# EAGLE design chickengate (EAGLE 9.2.2)
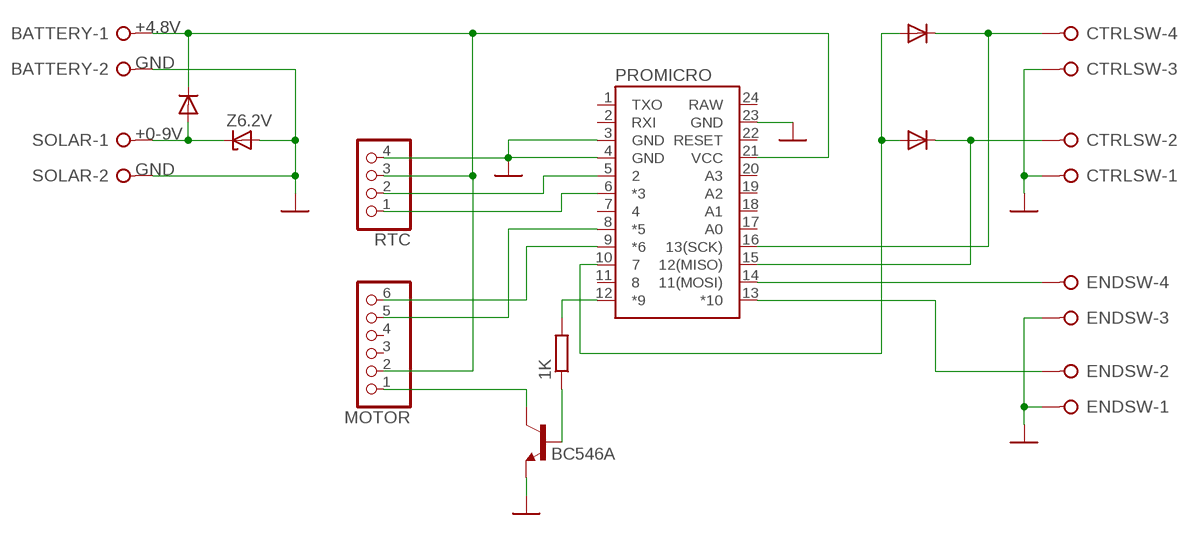
[diagram p0: schematic, sheet 1]

## Parts
1K  R-EU_0207/12  [0207/12]
BATTERY  W237-02P  [W237-132]
CTRLSW  W237-04P  [W237-4P]
D1  1N4004  [DO41-10]
D2  1N4004  [DO41-10]
D3  1N4004  [DO41-10]
ENDSW  W237-04P  [W237-4P]
MOTOR  PINHD-1X6  [1X06]
PROMICRO  SPARKFUN_PRO_MICRO  [SPARKFUN_PRO_MICRO]
Q1  BC546A  [TO92-EBC]
RTC  PINHD-1X4  [1X04]
SOLAR  W237-02P  [W237-132]
Z6.2V  ZPD  [DO35Z10]

## Nets
+0-9V: D1.A SOLAR.1 Z6.2V.C
+4.8V: BATTERY.1 D1.C MOTOR.2 PROMICRO.21(VCC) RTC.3
GND: BATTERY.2 CTRLSW.1 CTRLSW.3 ENDSW.1 ENDSW.3 PROMICRO.3(GND) PROMICRO.4(GND) PROMICRO.23(GND) Q1.E RTC.4 SOLAR.2 Z6.2V.A
M1: MOTOR.5 PROMICRO.8(*5)
M2: MOTOR.6 PROMICRO.9(*6)
N$1: 1K.2 PROMICRO.12(*9)
N$2: PROMICRO.5 RTC.2
N$4: PROMICRO.6(*3) RTC.1
N$5: 1K.1 Q1.B
N$6: MOTOR.1 Q1.C
N$9: CTRLSW.4 D2.C PROMICRO.16(13(SCK))
N$10: CTRLSW.2 D3.C PROMICRO.15(12(MISO))
N$11: D2.A D3.A PROMICRO.10
N$12: ENDSW.4 PROMICRO.14(11(MOSI))
N$13: ENDSW.2 PROMICRO.13(*10)
Unconnected: MOTOR.3 MOTOR.4 PROMICRO.1(TXO) PROMICRO.2(RXI) PROMICRO.7 PROMICRO.11 PROMICRO.17(A0) PROMICRO.18(A1) PROMICRO.19(A2) PROMICRO.20(A3) PROMICRO.22(RESET)

## Power pins joined to a net without a drawn wire
RAW: PROMICRO.24(RAW)

## Library data of the parts
1K = rcl:R-EU_: RESISTOR, European symbol; SPICEPREFIX: R
BATTERY SOLAR = con-wago-508:W237-02P: WAGO SREW CLAMP; OC_FARNELL: unknown; OC_NEWARK: unknown
CTRLSW ENDSW = con-wago-508:W237-04P: WAGO SREW CLAMP; OC_FARNELL: unknown; OC_NEWARK: unknown
D1-D3 = diode:1N4004: DIODE general purpose rectifier, 1 A
MOTOR = pinhead:PINHD-1X6: PIN HEADER
PROMICRO = SparkFun-Boards:SPARKFUN_PRO_MICRO: SparkFun Pro Micro Atmega32U4 compatible footprint. SparkFun Products: 3.3V/8MHz <https://www.sparkfun.com/products/12587> 5V/16MHz <https://www.sparkfun.com/products/12640>
Q1 = transistor-npn:BC546*: NPN Transistor
RTC = pinhead:PINHD-1X4: PIN HEADER
Z6.2V = diode:ZPD: Z DIODE 500 mW

## Board
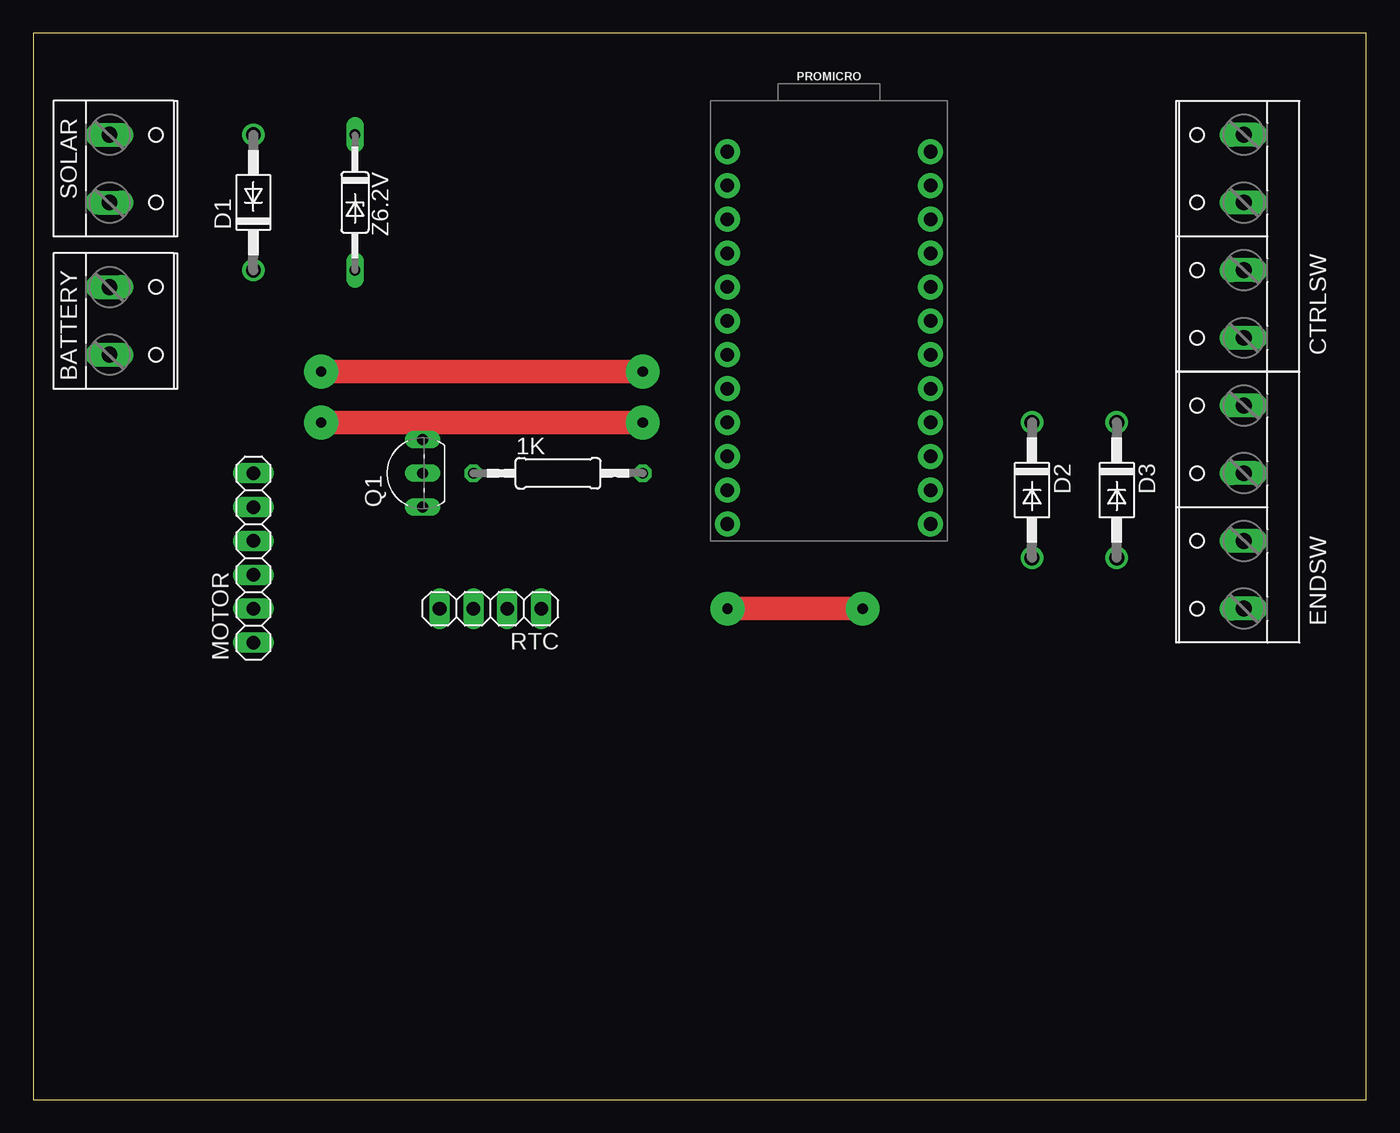
[diagram p1: board, top side]
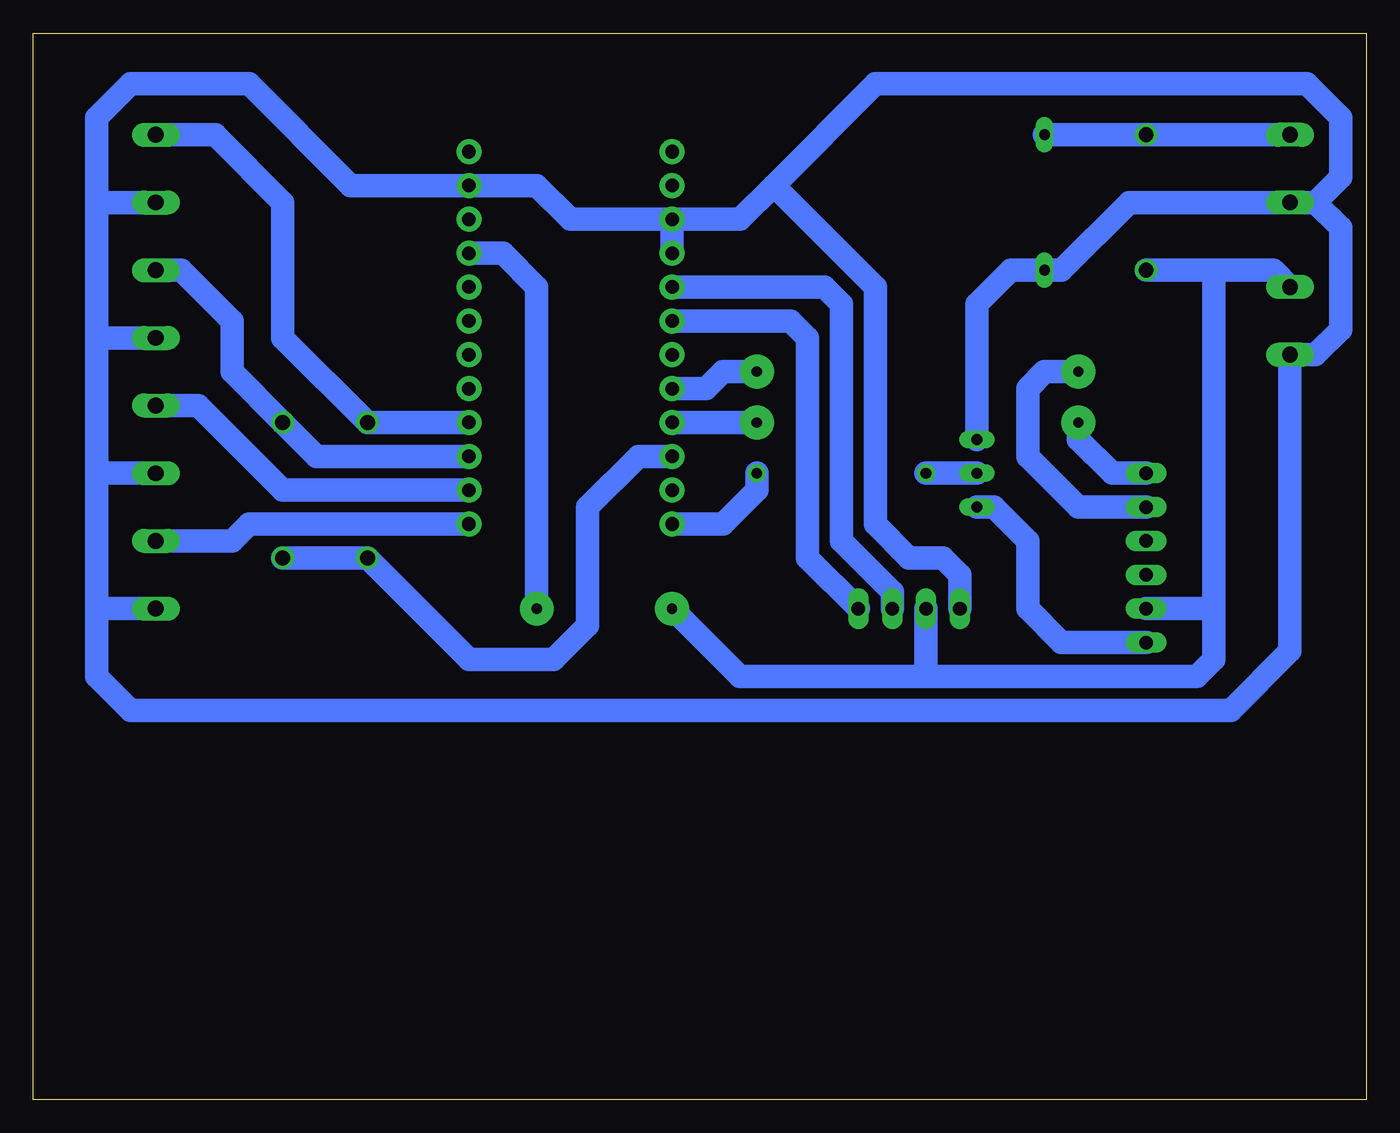
[diagram p2: board, bottom side, seen from below]

Size 100 x 80 mm. Coordinates in mm from the lower left corner, seen from the top.
Outline: 0,0 100,0 100,80 0,80 0,0
Copper layers (1*16): Top 0.035mm / dielectric 1.5mm / Bottom 0.035mm
Design rules "default": minimum track width 6mil, minimum drill 0.35mm, track to track 6mil, track to pad 6mil, pad to pad 6mil, via to via 6mil, smd to smd 6mil, copper to edge 40mil, drill to drill 6mil, minimum pad ring 10mil, minimum via ring 8mil, stop-mask expansion 4mil, vias tented up to drill 0mil, thermal gap 10mil

### Footprints (pad centres in the part's own frame; a part is rotated, then mirrored left to right if it is on the bottom)
0207/12 = drill 0.813 octagon: 1 -6.35,0; 2 6.35,0
W237-132 = drill 1.194 long: 1 -2.54,-0.635; 2 2.54,-0.635
W237-4P = drill 1.194 long: 1 -7.62,-0.635; 2 -2.54,-0.635; 3 2.54,-0.635; 4 7.62,-0.635
DO41-10 = drill 1.118: A 5.08,0; C -5.08,0
1X06 = drill 1.016 long: 1 -6.35,0; 2 -3.81,0; 3 -1.27,0; 4 1.27,0; 5 3.81,0; 6 6.35,0
SPARKFUN_PRO_MICRO = drill 1.016 pad 1.88: 1 -7.62,12.7; 2 -7.62,10.16; 3 -7.62,7.62; 4 -7.62,5.08; 5 -7.62,2.54; 6 -7.62,0; 7 -7.62,-2.54; 8 -7.62,-5.08; 9 -7.62,-7.62; 10 -7.62,-10.16; 11 -7.62,-12.7; 12 -7.62,-15.24; 13 7.62,-15.24; 14 7.62,-12.7; 15 7.62,-10.16; 16 7.62,-7.62; 17 7.62,-5.08; 18 7.62,-2.54; 19 7.62,0; 20 7.62,2.54; 21 7.62,5.08; 22 7.62,7.62; 23 7.62,10.16; 24 7.62,12.7
TO92-EBC = drill 0.813 long: B 0,-1.27; C -2.54,-1.27; E 2.54,-1.27
1X04 = drill 1.016 long: 1 -3.81,0; 2 -1.27,0; 3 1.27,0; 4 3.81,0
DO35Z10 = drill 0.813 long: A 5.08,0; C -5.08,0

### Placement (x,y rotation side)
1K  39.37,46.99 0 top
BATTERY  6.35,58.42 270 top
CTRLSW  90.17,64.77 90 top
D1  16.51,67.31 90 top
D2  74.93,45.72 270 top
D3  81.28,45.72 270 top
ENDSW  90.17,44.45 90 top
MOTOR  16.51,40.64 90 top
PROMICRO  59.69,58.42 0 top
Q1  27.94,46.99 90 top
RTC  34.29,36.83 180 top
SOLAR  6.35,69.85 270 top
Z6.2V  24.13,67.31 270 top

### Tracks (layer width: path | path; a pad name or v marks a point on that pad's centre or on a via)
+0-9V
  Bottom 1.778: SOLAR.1 D1.A Z6.2V.C
+4.8V  (via drill 0.76 pad 2.54)
  Top 1.778: v52.07,36.83 v62.23,36.83
  Bottom 1.778: PROMICRO.21 64.77,63.5 62.23,60.96 v62.23,36.83 | BATTERY.1 6.99,62.23 D1.C 11.43,62.23 11.43,36.83 | 11.43,36.83 11.43,33.02 12.7,31.75 33.02,31.75 | 33.02,31.75 46.99,31.75 v52.07,36.83 | RTC.3 33.02,31.75 | MOTOR.2 11.43,36.83
GND
  Bottom 1.778: 95.25,46.99 95.25,57.15 | 95.25,57.15 95.25,67.31 | 95.25,46.99 ENDSW.3 | 3.81,67.31 1.91,69.22 1.91,73.66 4.45,76.2 36.83,76.2 44.45,68.58 | 44.45,68.58 46.99,66.04 PROMICRO.3 | PROMICRO.3 PROMICRO.4 | PROMICRO.3 59.69,66.04 62.23,68.58 PROMICRO.23 76.2,68.58 83.82,76.2 92.71,76.2 95.25,73.66 95.25,67.31 | CTRLSW.3 95.25,67.31 | 3.81,67.31 SOLAR.2 17.78,67.31 22.86,62.23 Z6.2V.A 26.67,62.23 29.21,59.69 Q1.E | 3.81,67.31 1.91,65.41 1.91,57.78 3.81,55.88 BATTERY.2 5.71,33.66 10.16,29.21 92.71,29.21 95.25,31.75 95.25,36.83 | 95.25,36.83 95.25,46.99 | ENDSW.1 95.25,36.83 | RTC.4 30.48,39.37 31.75,40.64 34.29,40.64 36.83,43.18 36.83,60.96 44.45,68.58 | CTRLSW.1 95.25,57.15
M1  (via drill 0.76 pad 2.54)
  Top 1.778: v21.59,54.61 v45.72,54.61
  Bottom 1.778: PROMICRO.8 49.53,53.34 48.26,54.61 v45.72,54.61 | MOTOR.5 21.59,44.45 25.4,48.26 25.4,53.34 24.13,54.61 v21.59,54.61
M2  (via drill 0.76 pad 2.54)
  Top 1.778: v21.59,50.8 v45.72,50.8
  Bottom 1.778: PROMICRO.9 v45.72,50.8 | MOTOR.6 19.05,46.99 21.59,49.53 v21.59,50.8
N$1
  Bottom 1.778: 1K.2 45.72,45.72 48.26,43.18 PROMICRO.12
N$2
  Bottom 1.778: RTC.2 35.56,38.1 39.37,41.91 39.37,59.69 40.64,60.96 PROMICRO.5
N$4
  Bottom 1.778: RTC.1 41.91,40.64 41.91,57.15 43.18,58.42 PROMICRO.6
N$5
  Bottom 1.778: Q1.B 1K.1
N$6
  Bottom 1.778: MOTOR.1 22.86,34.29 25.4,36.83 25.4,41.91 27.94,44.45 Q1.C
N$9
  Bottom 1.778: CTRLSW.4 86.36,72.39 81.28,67.31 81.28,57.15 D2.C PROMICRO.16
N$10
  Bottom 1.778: PROMICRO.15 78.74,48.26 D3.C 85.09,54.61 85.09,58.42 88.9,62.23 CTRLSW.2
N$11
  Bottom 1.778: PROMICRO.10 54.61,48.26 58.42,44.45 58.42,35.56 60.96,33.02 67.31,33.02 D2.A D3.A
N$12
  Bottom 1.778: PROMICRO.14 81.28,45.72 87.63,52.07 ENDSW.4
N$13
  Bottom 1.778: PROMICRO.13 83.82,43.18 85.09,41.91 ENDSW.2